# Altium project MotorDrive.PrjPcb
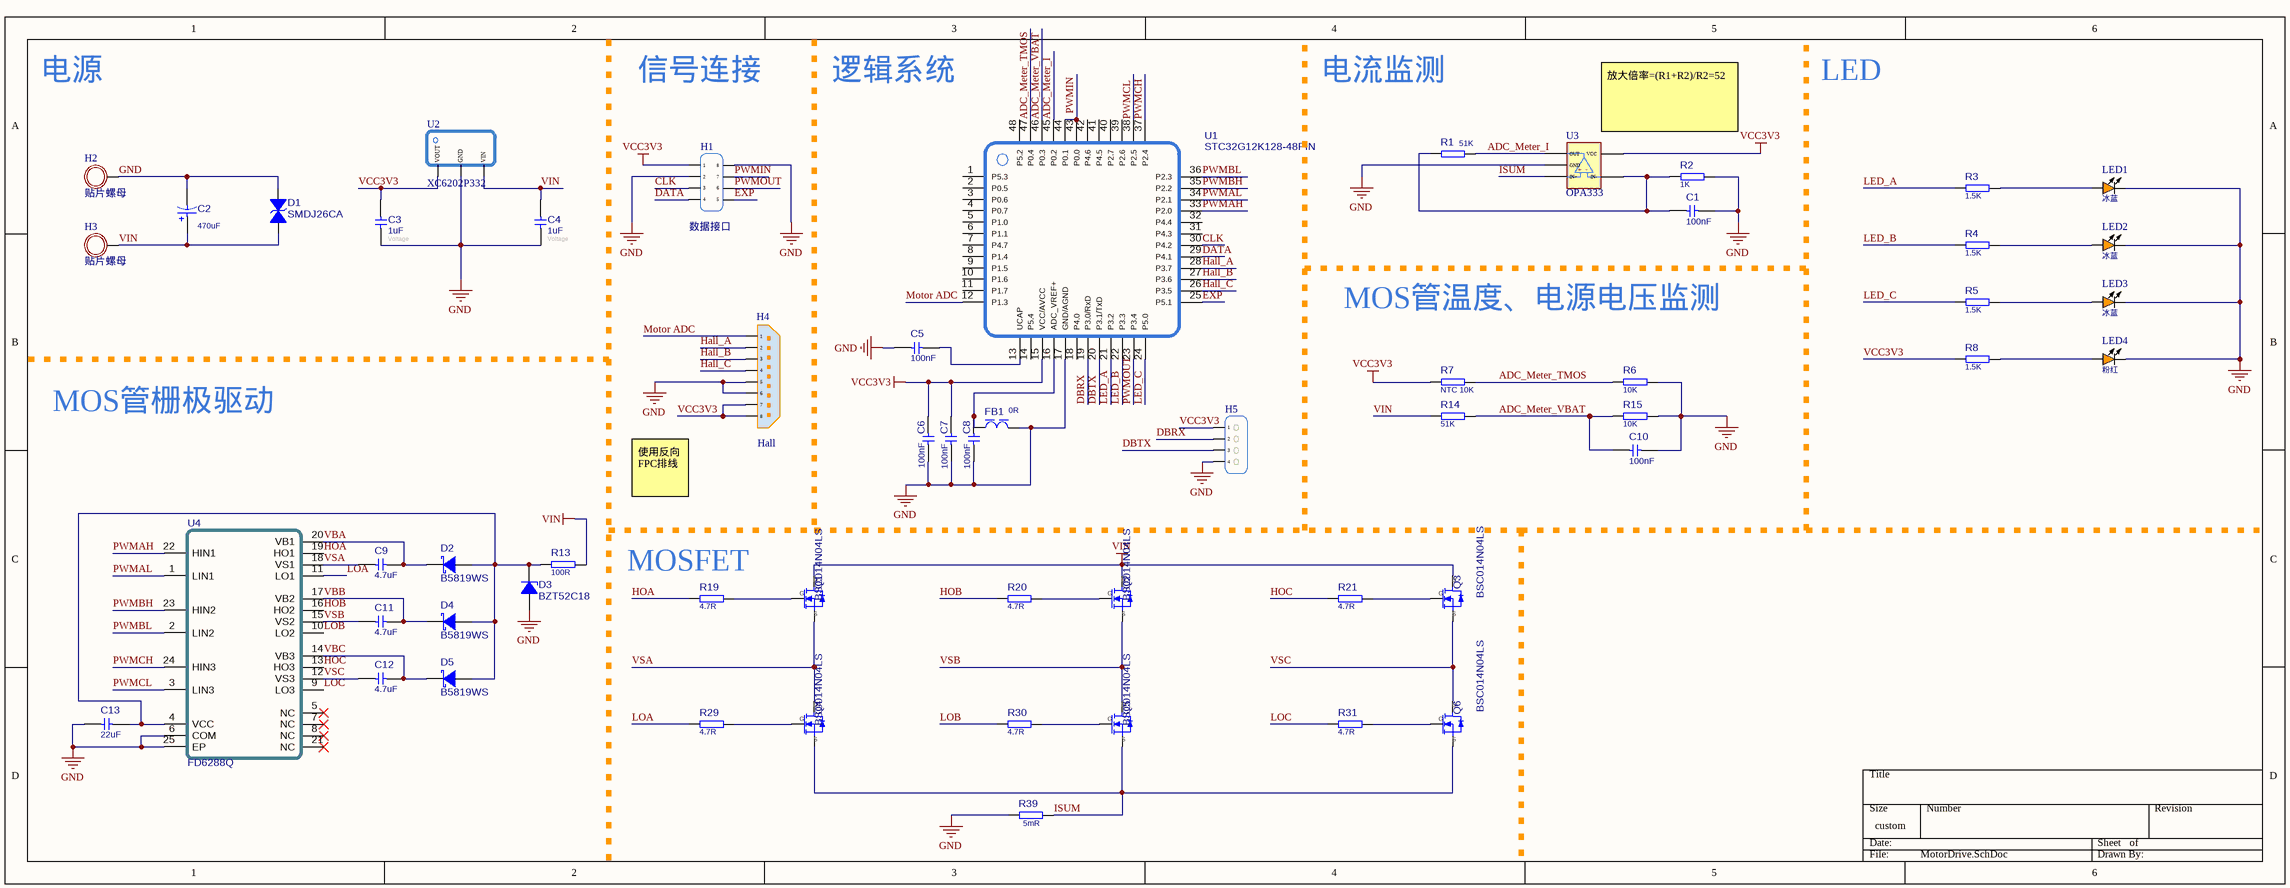
[diagram p0: MotorDrive.SchDoc]
1 sheet, 56 parts. Net scope: global (net labels, ports and power ports of the same name join across sheets).
Board file: MotorDrive.PcbDoc

## Sheet MotorDrive.SchDoc
size 508 x 193 mm; SheetNumber: 1; SheetTotal: 1

### Parts
C1  value 100nF  [Cap 0603_L]  (hidden comment: Cap-Chip)
C2  value 470uF  [CM D(6.3*5.4)]  (hidden comment: 极性电容)
C3  value 1uF  [Cap 0805_L]  (hidden comment: Cap-Chip)
C4  value 1uF  [Cap 0805_L]  (hidden comment: Cap-Chip)
C5  value 100nF  [Cap 0603_L]  (hidden comment: Cap-Chip)
C6  value 100nF  [Cap 0603_L]  (hidden comment: Cap-Chip)
C7  value 100nF  [Cap 0603_L]  (hidden comment: Cap-Chip)
C8  value 100nF  [Cap 0603_L]  (hidden comment: Cap-Chip)
C9  value 4.7uF  [Cap 0603_L]  (hidden comment: Cap-Chip)
C10  value 100nF  [Cap 0603_L]  (hidden comment: Cap-Chip)
C11  value 4.7uF  [Cap 0603_L]  (hidden comment: Cap-Chip)
C12  value 4.7uF  [Cap 0603_L]  (hidden comment: Cap-Chip)
C13  value 22uF  [Cap 0805_L]  (hidden comment: Cap-Chip)
D1  SMDJ26CA  [DO-214]
D2  B5819WS  [SOD-323]
D3  BZT52C18  [SOD-123-L]
D4  B5819WS  [SOD-323]
D5  B5819WS  [SOD-323]
FB1  value 0R  [Cap 0603_L]  (hidden comment: 磁珠)
H1  数据接口  [0.8mm 2X4]
H2  贴片螺母  [M4贴片螺丝]
H3  贴片螺母  [M4贴片螺丝]
H4  Hall  [FPC0.5 2H-WS-8P]
H5  HDR 1X4  [HDR2.54-LI-4P]  (value not drawn)
LED1  Color: 冰蓝  [LED 0603B]  (hidden comment: 发光二极管)
LED2  Color: 冰蓝  [LED 0603B]  (hidden comment: 发光二极管)
LED3  Color: 冰蓝  [LED 0603B]  (hidden comment: 发光二极管)
LED4  Color: 粉红  [LED 0603R]  (hidden comment: 发光二极管)
Q1  BSC014N04LS  [TSON3x3]
Q2  BSC014N04LS  [TSON3x3]
Q3  BSC014N04LS  [TSON3x3]
Q4  BSC014N04LS  [TSON3x3]
Q5  BSC014N04LS  [TSON3x3]
Q6  BSC014N04LS  [TSON3x3]
R1  value 51K  [Res 0603_L]  (hidden comment: Res-Chip)
R2  value 1K  [Res 0603_L]  (hidden comment: Res-Chip)
R3  value 1.5K  [Res 0603_L]  (hidden comment: Res-Chip)
R4  value 1.5K  [Res 0603_L]  (hidden comment: Res-Chip)
R5  value 1.5K  [Res 0603_L]  (hidden comment: Res-Chip)
R6  value 10K  [Res 0603_L]  (hidden comment: Res-Chip)
R7  value NTC 10K  [Res 0603_L]  (hidden comment: Res-Chip)
R8  value 1.5K  [Res 0603_L]  (hidden comment: Res-Chip)
R13  value 100R  [Res 0805_L]  (hidden comment: Res-Chip)
R14  value 51K  [Res 0603_L]  (hidden comment: Res-Chip)
R15  value 10K  [Res 0603_L]  (hidden comment: Res-Chip)
R19  value 4.7R  [Res 0603_L]  (hidden comment: Res-Chip)
R20  value 4.7R  [Res 0603_L]  (hidden comment: Res-Chip)
R21  value 4.7R  [Res 0603_L]  (hidden comment: Res-Chip)
R29  value 4.7R  [Res 0603_L]  (hidden comment: Res-Chip)
R30  value 4.7R  [Res 0603_L]  (hidden comment: Res-Chip)
R31  value 4.7R  [Res 0603_L]  (hidden comment: Res-Chip)
R39  value 5mR  [Res 2512_L]  (hidden comment: Res-Chip)
U1  STC32G12K128-48PIN  [LQFP48 7X7_M]
U2  XC6202P332  [SOT89_L]
U3  OPA333  [SOT23-5L]
U4  FD6288Q  [QFN24 4x4_M]

### Nets
GND: C1.2 C2.2 C3.1 C4.1 C5.1 C6.1 C7.1 C8.1 C10.2 C13.1 D1.1 D3.A FB1.2 H1.2 H1.8 H2.1 H4.5 H4.6 H5.4 LED1.2(K) LED2.2(K) LED3.2(K) LED4.2(K) R2.2 R6.2 R15.2 R39.1 U1.17(GND/AGND) U2.2(GND) U3.2(GND) U4.6(COM) U4.25(EP)
VCC3V3: C3.2 C6.2 C7.2 H1.1 H4.7 H4.8 H5.1 R7.1 R8.1 U1.15(VCC/AVCC) U2.1(VOUT) U3.5(VCC)
VIN: C2.1 C4.2 D1.2 H3.1 Q1.1(D) Q2.1(D) Q3.1(D) R13.2 R14.1 U2.3(VIN)
ADC_Meter_I: R1.2 U1.45(P0.2) U3.1(OUT)
ADC_Meter_TMOS: R6.1 R7.2 U1.47(P0.4)
ADC_Meter_VBAT: C10.1 R14.2 R15.1 U1.46(P0.3)
CLK: H1.3 U1.30(P4.2)
DATA: H1.4 U1.29(P4.1)
DBRX: H5.2 U1.19(P3.0/RxD)
DBTX: H5.3 U1.20(P3.1/TxD)
EXP: H1.5 U1.25(P5.1)
Hall_A: H4.2 U1.28(P3.7)
Hall_B: H4.3 U1.27(P3.6)
Hall_C: H4.4 U1.26(P3.5)
HOA: R19.1 U4.19(HO1)
HOB: R20.1 U4.16(HO2)
HOC: R21.1 U4.13(HO3)
ISUM: Q4.3(S) Q5.3(S) Q6.3(S) R39.2 U3.3(IN+)
LED_A: R3.1 U1.21(P3.2)
LED_B: R4.1 U1.22(P3.3)
LED_C: R5.1 U1.24(P5.0)
LOA: R29.1 U4.11(LO1)
LOB: R30.1 U4.10(LO2)
LOC: R31.1 U4.9(LO3)
Motor ADC: H4.1 U1.12(P1.3)
PWMAH: U1.33(P2.0) U4.22(HIN1)
PWMAL: U1.34(P2.1) U4.1(LIN1)
PWMBH: U1.35(P2.2) U4.23(HIN2)
PWMBL: U1.36(P2.3) U4.2(LIN2)
PWMCH: U1.37(P2.4) U4.24(HIN3)
PWMCL: U1.38(P2.5) U4.3(LIN3)
PWMIN: H1.7 U1.43(P0.0) U1.44(P0.1)
PWMOUT: H1.6 U1.23(P3.4)
VBA: C9.2 D2.K U4.20(VB1)
VBB: C11.2 D4.K U4.17(VB2)
VBC: C12.2 D5.K U4.14(VB3)
VSA: C9.1 Q1.3(S) Q4.1(D) U4.18(VS1)
VSB: C11.1 Q2.3(S) Q5.1(D) U4.15(VS2)
VSC: C12.1 Q3.3(S) Q6.1(D) U4.12(VS3)
NetC1_1: C1.1 R1.1 R2.1 U3.4(IN-)
NetC5_2: C5.2 U1.13(UCAP)
NetC8_2: C8.2 FB1.1 U1.16(ADC_VREF+)
NetC13_2: C13.2 D2.A D3.K D4.A D5.A R13.1 U4.4(VCC)
NetLED1_1: LED1.1(A) R3.2
NetLED2_1: LED2.1(A) R4.2
NetLED3_1: LED3.1(A) R5.2
NetLED4_1: LED4.1(A) R8.2
NetQ1_2: Q1.2(G) R19.2
NetQ2_2: Q2.2(G) R20.2
NetQ3_2: Q3.2(G) R21.2
NetQ4_2: Q4.2(G) R29.2
NetQ5_2: Q5.2(G) R30.2
NetQ6_2: Q6.2(G) R31.2

Not connected (* = marked no-connect by the designer): U1 1(P5.3) 2(P0.5) 3(P0.6) 4(P0.7) 5(P1.0) 6(P1.1) 7(P4.7) 8(P1.4) 9(P1.5) 10(P1.6) 11(P1.7) 14(P5.4) 18(P4.0) 31(P4.3) 32(P4.4) 39(P2.6) 40(P2.7) 41(P4.5) 42(P4.6) 48(P5.2); U4 5(NC)* 7(NC)* 8(NC)* 21(NC)*

### Notes on the sheet
- 电源
- 信号连接
- 逻辑系统
- 电流监测
- LED
- (near U3) 放大倍率=(R1+R2)/R2=52
- MOS管温度、电源电压监测
- MOS管栅极驱动
- 使用反向FPC排线
- (near R19) MOSFET
- (in symbol OPA333) +; -

### Library data of the parts
C2 = 极性电容: 固态电容/电解电容/钽电容; Revision: V1.0; Voltage: Voltage
D1 = Diode TVS Bi-Dir: TRANSIENT VOLTAGE  SUPPRESSOR DIODE; Imax: 500mA; Published: 8-Jun-2000; Publisher: Altium Limited; Price(RMB): 0.000
D2 D4 D5 = B5819WS: B5819WS 肖特基二极管; Revision: V1.0; Value: B5819WS
D3 = BZT52C18: 稳压二极管 齐纳二极管  Zener Diode; Published: 8-Jun-2000; Revision: July-2002: Re-released for DXP Platform.; Publisher: Altium Limited; Price(RMB): 0.000
FB1 = 磁珠: 贴片磁珠; DCR: .1m; Frequency: @100MHz; Imax: 500mA; Published: 2020-12-18; Revision: V1.0
H1 = 对板连接器 2X4
H4 = FPC_8Pin
Q1-Q6 = BSC014N04LS: 英飞凌 N沟 MOS
R1-R8 R13-R15 R19-R21 R29-R31 R39 = Res-Chip: 贴片电阻; Power: 1/8W; Tolerance: ±1%; Revision: V1.0
U1 = STC32G12K128-48PIN: STC32G12K128 LQFP48
U2 = XC6202P332: LDO 3V3 Max=200mA
U4 = FD6288Q: FD6288Q 三相栅极驱动器
C1 C3-C13 = Cap-Chip: Revision: V1.0; Voltage: Voltage